# EAGLE schematic Decoder4to16 (EAGLE 7.3.0)

## Sheet 1 of 3
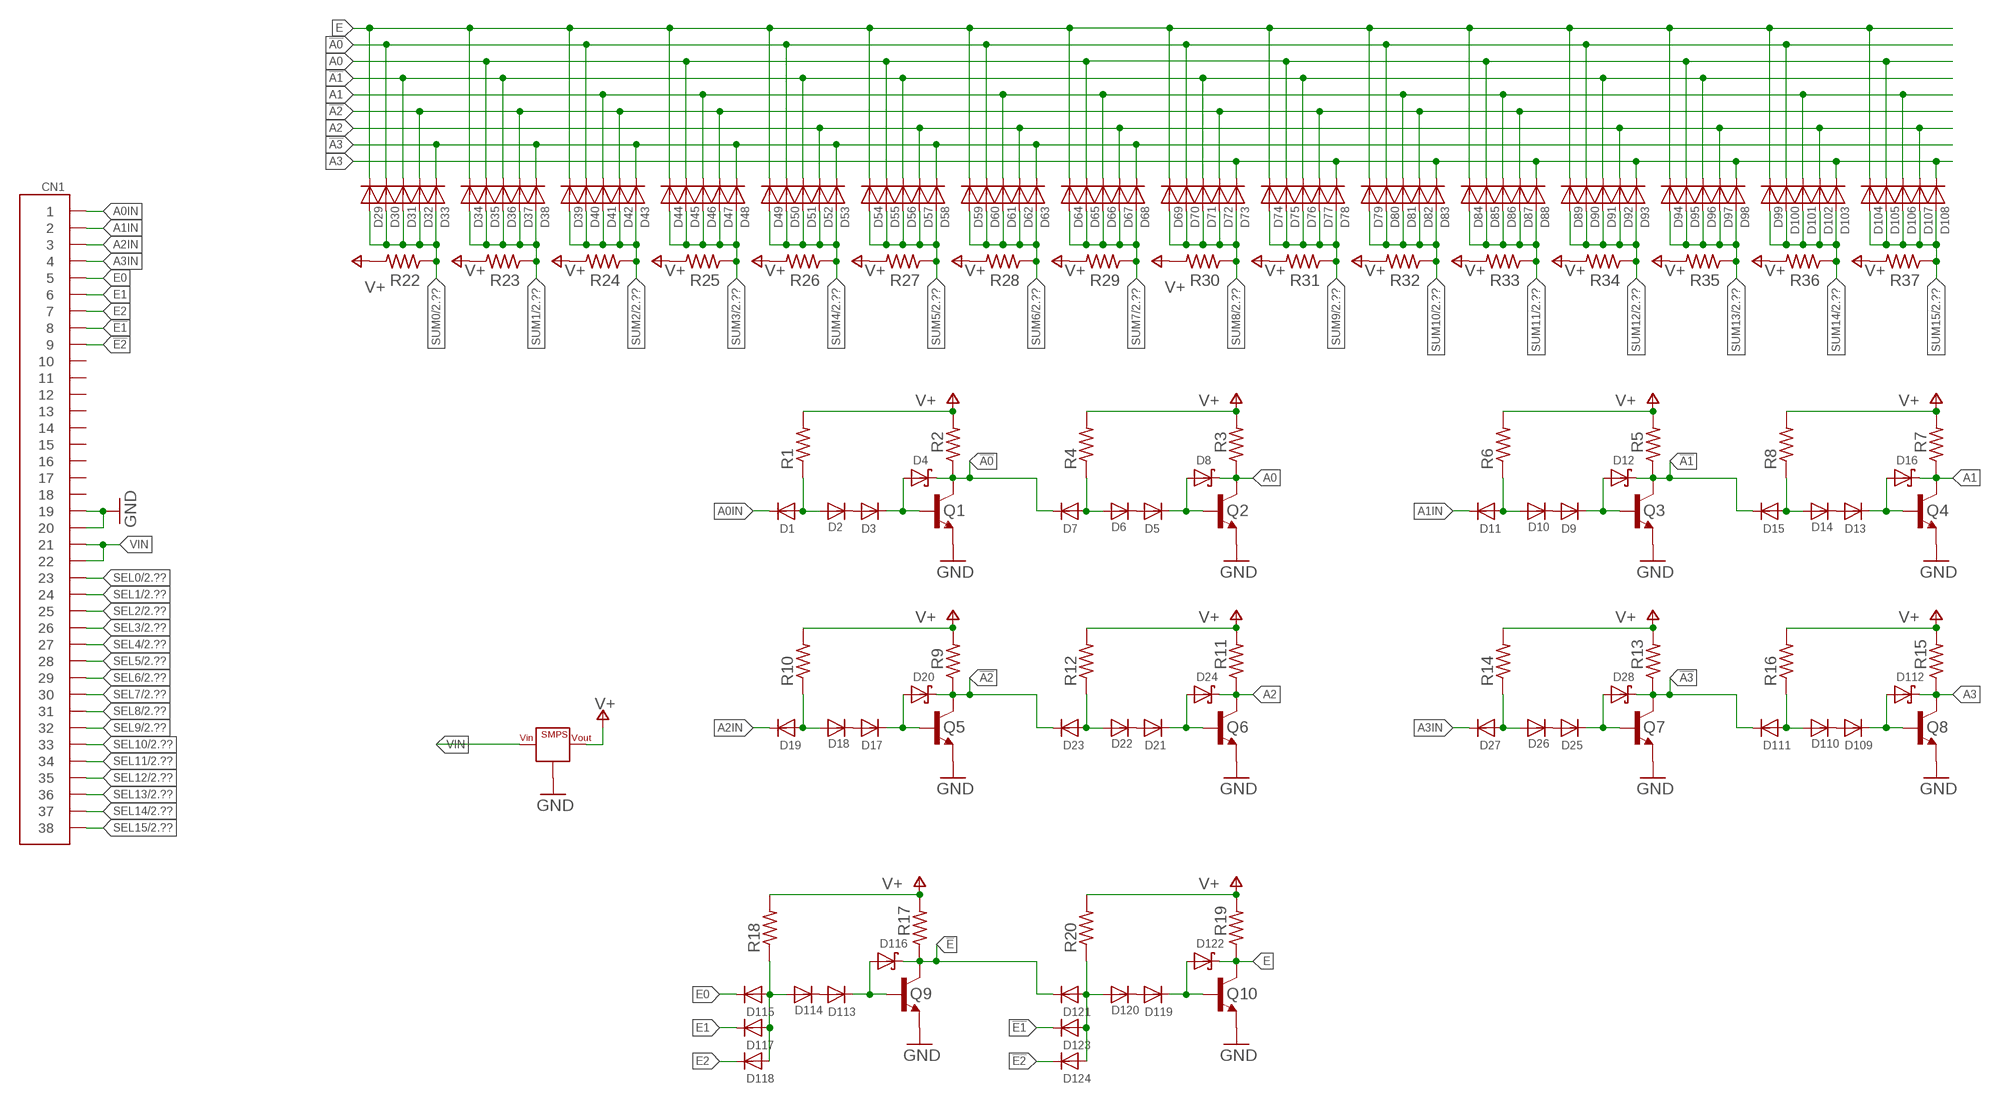
[diagram p0: schematic, sheet 1]

### Parts
CN1  HD38-HP  [HD38-HOLEPAD]
D1  DIODE-SOD323  [SOD323F]
D2  DIODE-SOD323  [SOD323F]
D3  DIODE-SOD323  [SOD323F]
D4  SCHOTTKYSOT323  [SOT23]
D5  DIODE-SOD323  [SOD323F]
D6  DIODE-SOD323  [SOD323F]
D7  DIODE-SOD323  [SOD323F]
D8  SCHOTTKYSOT323  [SOT23]
D9  DIODE-SOD323  [SOD323F]
D10  DIODE-SOD323  [SOD323F]
D11  DIODE-SOD323  [SOD323F]
D12  SCHOTTKYSOT323  [SOT23]
D13  DIODE-SOD323  [SOD323F]
D14  DIODE-SOD323  [SOD323F]
D15  DIODE-SOD323  [SOD323F]
D16  SCHOTTKYSOT323  [SOT23]
D17  DIODE-SOD323  [SOD323F]
D18  DIODE-SOD323  [SOD323F]
D19  DIODE-SOD323  [SOD323F]
D20  SCHOTTKYSOT323  [SOT23]
D21  DIODE-SOD323  [SOD323F]
D22  DIODE-SOD323  [SOD323F]
D23  DIODE-SOD323  [SOD323F]
D24  SCHOTTKYSOT323  [SOT23]
D25  DIODE-SOD323  [SOD323F]
D26  DIODE-SOD323  [SOD323F]
D27  DIODE-SOD323  [SOD323F]
D28  SCHOTTKYSOT323  [SOT23]
D29  DIODE-SOD323  [SOD323F]
D30  DIODE-SOD323  [SOD323F]
D31  DIODE-SOD323  [SOD323F]
D32  DIODE-SOD323  [SOD323F]
D33  DIODE-SOD323  [SOD323F]
D34  DIODE-SOD323  [SOD323F]
D35  DIODE-SOD323  [SOD323F]
D36  DIODE-SOD323  [SOD323F]
D37  DIODE-SOD323  [SOD323F]
D38  DIODE-SOD323  [SOD323F]
D39  DIODE-SOD323  [SOD323F]
D40  DIODE-SOD323  [SOD323F]
D41  DIODE-SOD323  [SOD323F]
D42  DIODE-SOD323  [SOD323F]
D43  DIODE-SOD323  [SOD323F]
D44  DIODE-SOD323  [SOD323F]
D45  DIODE-SOD323  [SOD323F]
D46  DIODE-SOD323  [SOD323F]
D47  DIODE-SOD323  [SOD323F]
D48  DIODE-SOD323  [SOD323F]
D49  DIODE-SOD323  [SOD323F]
D50  DIODE-SOD323  [SOD323F]
D51  DIODE-SOD323  [SOD323F]
D52  DIODE-SOD323  [SOD323F]
D53  DIODE-SOD323  [SOD323F]
D54  DIODE-SOD323  [SOD323F]
D55  DIODE-SOD323  [SOD323F]
D56  DIODE-SOD323  [SOD323F]
D57  DIODE-SOD323  [SOD323F]
D58  DIODE-SOD323  [SOD323F]
D59  DIODE-SOD323  [SOD323F]
D60  DIODE-SOD323  [SOD323F]
D61  DIODE-SOD323  [SOD323F]
D62  DIODE-SOD323  [SOD323F]
D63  DIODE-SOD323  [SOD323F]
D64  DIODE-SOD323  [SOD323F]
D65  DIODE-SOD323  [SOD323F]
D66  DIODE-SOD323  [SOD323F]
D67  DIODE-SOD323  [SOD323F]
D68  DIODE-SOD323  [SOD323F]
D69  DIODE-SOD323  [SOD323F]
D70  DIODE-SOD323  [SOD323F]
D71  DIODE-SOD323  [SOD323F]
D72  DIODE-SOD323  [SOD323F]
D73  DIODE-SOD323  [SOD323F]
D74  DIODE-SOD323  [SOD323F]
D75  DIODE-SOD323  [SOD323F]
D76  DIODE-SOD323  [SOD323F]
D77  DIODE-SOD323  [SOD323F]
D78  DIODE-SOD323  [SOD323F]
D79  DIODE-SOD323  [SOD323F]
D80  DIODE-SOD323  [SOD323F]
D81  DIODE-SOD323  [SOD323F]
D82  DIODE-SOD323  [SOD323F]
D83  DIODE-SOD323  [SOD323F]
D84  DIODE-SOD323  [SOD323F]
D85  DIODE-SOD323  [SOD323F]
D86  DIODE-SOD323  [SOD323F]
D87  DIODE-SOD323  [SOD323F]
D88  DIODE-SOD323  [SOD323F]
D89  DIODE-SOD323  [SOD323F]
D90  DIODE-SOD323  [SOD323F]
D91  DIODE-SOD323  [SOD323F]
D92  DIODE-SOD323  [SOD323F]
D93  DIODE-SOD323  [SOD323F]
D94  DIODE-SOD323  [SOD323F]
D95  DIODE-SOD323  [SOD323F]
D96  DIODE-SOD323  [SOD323F]
D97  DIODE-SOD323  [SOD323F]
D98  DIODE-SOD323  [SOD323F]
D99  DIODE-SOD323  [SOD323F]
D100  DIODE-SOD323  [SOD323F]
D101  DIODE-SOD323  [SOD323F]
D102  DIODE-SOD323  [SOD323F]
D103  DIODE-SOD323  [SOD323F]
D104  DIODE-SOD323  [SOD323F]
D105  DIODE-SOD323  [SOD323F]
D106  DIODE-SOD323  [SOD323F]
D107  DIODE-SOD323  [SOD323F]
D108  DIODE-SOD323  [SOD323F]
D109  DIODE-SOD323  [SOD323F]
D110  DIODE-SOD323  [SOD323F]
D111  DIODE-SOD323  [SOD323F]
D112  SCHOTTKYSOT323  [SOT23]
D113  DIODE-SOD323  [SOD323F]
D114  DIODE-SOD323  [SOD323F]
D115  DIODE-SOD323  [SOD323F]
D116  SCHOTTKYSOT323  [SOT23]
D117  DIODE-SOD323  [SOD323F]
D118  DIODE-SOD323  [SOD323F]
D119  DIODE-SOD323  [SOD323F]
D120  DIODE-SOD323  [SOD323F]
D121  DIODE-SOD323  [SOD323F]
D122  SCHOTTKYSOT323  [SOT23]
D123  DIODE-SOD323  [SOD323F]
D124  DIODE-SOD323  [SOD323F]
Q1  BC547-SOT23  [SOT23]
Q2  BC547-SOT23  [SOT23]
Q3  BC547-SOT23  [SOT23]
Q4  BC547-SOT23  [SOT23]
Q5  BC547-SOT23  [SOT23]
Q6  BC547-SOT23  [SOT23]
Q7  BC547-SOT23  [SOT23]
Q8  BC547-SOT23  [SOT23]
Q9  BC547-SOT23  [SOT23]
Q10  BC547-SOT23  [SOT23]
R1  470  R-0805  [R0805]
R2  150  R-0805  [R0805]
R3  150  R-0805  [R0805]
R4  470  R-0805  [R0805]
R5  150  R-0805  [R0805]
R6  470  R-0805  [R0805]
R7  150  R-0805  [R0805]
R8  470  R-0805  [R0805]
R9  150  R-0805  [R0805]
R10  470  R-0805  [R0805]
R11  150  R-0805  [R0805]
R12  470  R-0805  [R0805]
R13  150  R-0805  [R0805]
R14  470  R-0805  [R0805]
R15  150  R-0805  [R0805]
R16  470  R-0805  [R0805]
R17  150  R-0805  [R0805]
R18  470  R-0805  [R0805]
R19  150  R-0805  [R0805]
R20  470  R-0805  [R0805]
R22  R-0805  [R0805]
R23  R-0805  [R0805]
R24  R-0805  [R0805]
R25  R-0805  [R0805]
R26  R-0805  [R0805]
R27  R-0805  [R0805]
R28  R-0805  [R0805]
R29  R-0805  [R0805]
R30  R-0805  [R0805]
R31  R-0805  [R0805]
R32  R-0805  [R0805]
R33  R-0805  [R0805]
R34  R-0805  [R0805]
R35  R-0805  [R0805]
R36  R-0805  [R0805]
R37  R-0805  [R0805]
VR1  SMPS  [BUCK1722]

### Nets
!A0: D4.3(C) D7.C D30.C D40.C D50.C D60.C D70.C D80.C D90.C D100.C Q1.3(C) R2.1
!A1: D12.3(C) D15.C D31.C D36.C D51.C D56.C D71.C D76.C D91.C D96.C Q3.3(C) R5.1
!A2: D20.3(C) D23.C D32.C D37.C D42.C D47.C D72.C D77.C D82.C D87.C Q5.3(C) R9.1
!A3: D28.3(C) D33.C D38.C D43.C D48.C D53.C D58.C D63.C D68.C D111.C Q7.3(C) R13.1
!E: D116.3(C) D121.C Q9.3(C) R17.1
!E1: CN1.P8@1 CN1.P8@2 D123.C
!E2: CN1.P9@1 CN1.P9@2 D124.C
A0: D8.3(C) D35.C D45.C D55.C D65.C D75.C D85.C D95.C D105.C Q2.3(C) R3.1
A0IN: CN1.P1@1 CN1.P1@2 D1.C
A1: D16.3(C) D41.C D46.C D61.C D66.C D81.C D86.C D101.C D106.C Q4.3(C) R7.1
A1IN: CN1.P2@1 CN1.P2@2 D11.C
A2: D24.3(C) D52.C D57.C D62.C D67.C D92.C D97.C D102.C D107.C Q6.3(C) R11.1
A2IN: CN1.P3@1 CN1.P3@2 D19.C
A3: D73.C D78.C D83.C D88.C D93.C D98.C D103.C D108.C D112.3(C) Q8.3(C) R15.1
A3IN: CN1.P4@1 CN1.P4@2 D27.C
E: D29.C D34.C D39.C D44.C D49.C D54.C D59.C D64.C D69.C D74.C D79.C D84.C D89.C D94.C D99.C D104.C D122.3(C) Q10.3(C) R19.1
E0: CN1.P5@1 CN1.P5@2 D115.C
E1: CN1.P6@1 CN1.P6@2 D117.C
E2: CN1.P7@1 CN1.P7@2 D118.C
GND: CN1.P19@1 CN1.P19@2 CN1.P20@1 CN1.P20@2 Q1.2(E) Q2.2(E) Q3.2(E) Q4.2(E) Q5.2(E) Q6.2(E) Q7.2(E) Q8.2(E) Q9.2(E) Q10.2(E) VR1.GND@1(GND) VR1.GND@2(GND) VR1.GND@3(GND) VR1.GND@4(GND) ; also sheet 2
N$1: D1.A D2.A R1.1
N$2: D3.C D4.1(A) Q1.1(B)
N$3: D2.C D3.A
N$4: D5.C D8.1(A) Q2.1(B)
N$5: D5.A D6.C
N$6: D6.A D7.A R4.1
N$7: D9.C D12.1(A) Q3.1(B)
N$8: D9.A D10.C
N$9: D10.A D11.A R6.1
N$10: D13.C D16.1(A) Q4.1(B)
N$11: D13.A D14.C
N$12: D14.A D15.A R8.1
N$13: D17.C D20.1(A) Q5.1(B)
N$14: D17.A D18.C
N$15: D18.A D19.A R10.1
N$16: D21.C D24.1(A) Q6.1(B)
N$17: D21.A D22.C
N$18: D22.A D23.A R12.1
N$19: D25.C D28.1(A) Q7.1(B)
N$20: D25.A D26.C
N$21: D26.A D27.A R14.1
N$22: D109.C D112.1(A) Q8.1(B)
N$23: D109.A D110.C
N$24: D110.A D111.A R16.1
N$38: D113.C D116.1(A) Q9.1(B)
N$39: D113.A D114.C
N$40: D119.C D122.1(A) Q10.1(B)
N$41: D119.A D120.C
N$42: D120.A D121.A D123.A D124.A R20.1
N$43: D114.A D115.A D117.A D118.A R18.1
SEL0: CN1.P23@1 CN1.P23@2 ; also sheet 2
SEL1: CN1.P24@1 CN1.P24@2 ; also sheet 2
SEL2: CN1.P25@1 CN1.P25@2 ; also sheet 2
SEL3: CN1.P26@1 CN1.P26@2 ; also sheet 2
SEL4: CN1.P27@1 CN1.P27@2 ; also sheet 2
SEL5: CN1.P28@1 CN1.P28@2 ; also sheet 2
SEL6: CN1.P29@1 CN1.P29@2 ; also sheet 2
SEL7: CN1.P30@1 CN1.P30@2 ; also sheet 2
SEL8: CN1.P31@1 CN1.P31@2 ; also sheet 2
SEL9: CN1.P32@1 CN1.P32@2 ; also sheet 2
SEL10: CN1.P33@1 CN1.P33@2 ; also sheet 2
SEL11: CN1.P34@1 CN1.P34@2 ; also sheet 2
SEL12: CN1.P35@1 CN1.P35@2 ; also sheet 2
SEL13: CN1.P36@1 CN1.P36@2 ; also sheet 2
SEL14: CN1.P37@1 CN1.P37@2 ; also sheet 2
SEL15: CN1.P38@1 CN1.P38@2 ; also sheet 2
SUM0: D29.A D30.A D31.A D32.A D33.A R22.1 ; also sheet 2
SUM1: D34.A D35.A D36.A D37.A D38.A R23.1 ; also sheet 2
SUM2: D39.A D40.A D41.A D42.A D43.A R24.1 ; also sheet 2
SUM3: D44.A D45.A D46.A D47.A D48.A R25.1 ; also sheet 2
SUM4: D49.A D50.A D51.A D52.A D53.A R26.1 ; also sheet 2
SUM5: D54.A D55.A D56.A D57.A D58.A R27.1 ; also sheet 2
SUM6: D59.A D60.A D61.A D62.A D63.A R28.1 ; also sheet 2
SUM7: D64.A D65.A D66.A D67.A D68.A R29.1 ; also sheet 2
SUM8: D69.A D70.A D71.A D72.A D73.A R30.1 ; also sheet 2
SUM9: D74.A D75.A D76.A D77.A D78.A R31.1 ; also sheet 2
SUM10: D79.A D80.A D81.A D82.A D83.A R32.1 ; also sheet 2
SUM11: D84.A D85.A D86.A D87.A D88.A R33.1 ; also sheet 2
SUM12: D89.A D90.A D91.A D92.A D93.A R34.1 ; also sheet 2
SUM13: D94.A D95.A D96.A D97.A D98.A R35.1 ; also sheet 2
SUM14: D99.A D100.A D101.A D102.A D103.A R36.1 ; also sheet 2
SUM15: D104.A D105.A D106.A D107.A D108.A R37.1 ; also sheet 2
V+: R1.2 R2.2 R3.2 R4.2 R5.2 R6.2 R7.2 R8.2 R9.2 R10.2 R11.2 R12.2 R13.2 R14.2 R15.2 R16.2 R17.2 R18.2 R19.2 R20.2 R22.2 R23.2 R24.2 R25.2 R26.2 R27.2 R28.2 R29.2 R30.2 R31.2 R32.2 R33.2 R34.2 R35.2 R36.2 R37.2 VR1.OUT@1(VOUT) VR1.OUT@2(VOUT) ; also sheet 2
VIN: CN1.P21@1 CN1.P21@2 CN1.P22@1 CN1.P22@2 VR1.IN@1(VIN) VR1.IN@2(VIN)
Unconnected: CN1.P10@1 CN1.P10@2 CN1.P11@1 CN1.P11@2 CN1.P12@1 CN1.P12@2 CN1.P13@1 CN1.P13@2 CN1.P14@1 CN1.P14@2 CN1.P15@1 CN1.P15@2 CN1.P16@1 CN1.P16@2 CN1.P17@1 CN1.P17@2 CN1.P18@1 CN1.P18@2

## Sheet 2 of 3
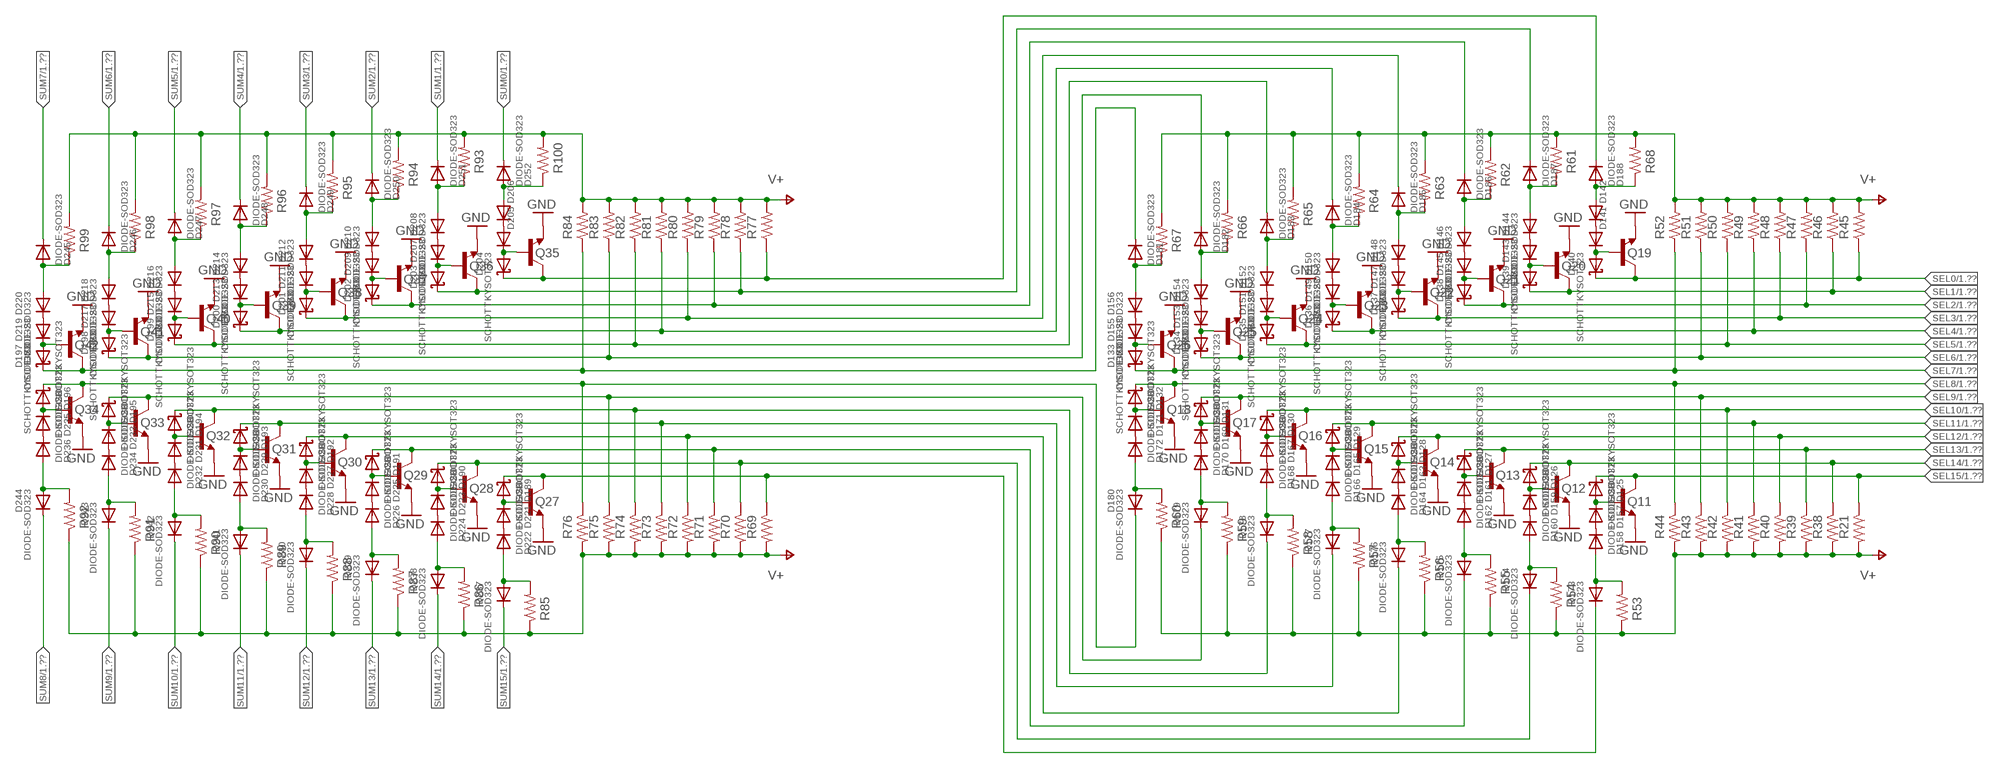
[diagram p1: schematic, sheet 2]

### Parts
D125  SCHOTTKYSOT323  [SOT23]
D126  SCHOTTKYSOT323  [SOT23]
D127  SCHOTTKYSOT323  [SOT23]
D128  SCHOTTKYSOT323  [SOT23]
D129  SCHOTTKYSOT323  [SOT23]
D130  SCHOTTKYSOT323  [SOT23]
D131  SCHOTTKYSOT323  [SOT23]
D132  SCHOTTKYSOT323  [SOT23]
D133  SCHOTTKYSOT323  [SOT23]
D134  SCHOTTKYSOT323  [SOT23]
D135  SCHOTTKYSOT323  [SOT23]
D136  SCHOTTKYSOT323  [SOT23]
D137  SCHOTTKYSOT323  [SOT23]
D138  SCHOTTKYSOT323  [SOT23]
D139  SCHOTTKYSOT323  [SOT23]
D140  SCHOTTKYSOT323  [SOT23]
D141  DIODE-SOD323  [SOD323F]
D142  DIODE-SOD323  [SOD323F]
D143  DIODE-SOD323  [SOD323F]
D144  DIODE-SOD323  [SOD323F]
D145  DIODE-SOD323  [SOD323F]
D146  DIODE-SOD323  [SOD323F]
D147  DIODE-SOD323  [SOD323F]
D148  DIODE-SOD323  [SOD323F]
D149  DIODE-SOD323  [SOD323F]
D150  DIODE-SOD323  [SOD323F]
D151  DIODE-SOD323  [SOD323F]
D152  DIODE-SOD323  [SOD323F]
D153  DIODE-SOD323  [SOD323F]
D154  DIODE-SOD323  [SOD323F]
D155  DIODE-SOD323  [SOD323F]
D156  DIODE-SOD323  [SOD323F]
D157  DIODE-SOD323  [SOD323F]
D158  DIODE-SOD323  [SOD323F]
D159  DIODE-SOD323  [SOD323F]
D160  DIODE-SOD323  [SOD323F]
D161  DIODE-SOD323  [SOD323F]
D162  DIODE-SOD323  [SOD323F]
D163  DIODE-SOD323  [SOD323F]
D164  DIODE-SOD323  [SOD323F]
D165  DIODE-SOD323  [SOD323F]
D166  DIODE-SOD323  [SOD323F]
D167  DIODE-SOD323  [SOD323F]
D168  DIODE-SOD323  [SOD323F]
D169  DIODE-SOD323  [SOD323F]
D170  DIODE-SOD323  [SOD323F]
D171  DIODE-SOD323  [SOD323F]
D172  DIODE-SOD323  [SOD323F]
D173  DIODE-SOD323  [SOD323F]
D174  DIODE-SOD323  [SOD323F]
D175  DIODE-SOD323  [SOD323F]
D176  DIODE-SOD323  [SOD323F]
D177  DIODE-SOD323  [SOD323F]
D178  DIODE-SOD323  [SOD323F]
D179  DIODE-SOD323  [SOD323F]
D180  DIODE-SOD323  [SOD323F]
D181  DIODE-SOD323  [SOD323F]
D182  DIODE-SOD323  [SOD323F]
D183  DIODE-SOD323  [SOD323F]
D184  DIODE-SOD323  [SOD323F]
D185  DIODE-SOD323  [SOD323F]
D186  DIODE-SOD323  [SOD323F]
D187  DIODE-SOD323  [SOD323F]
D188  DIODE-SOD323  [SOD323F]
D189  SCHOTTKYSOT323  [SOT23]
D190  SCHOTTKYSOT323  [SOT23]
D191  SCHOTTKYSOT323  [SOT23]
D192  SCHOTTKYSOT323  [SOT23]
D193  SCHOTTKYSOT323  [SOT23]
D194  SCHOTTKYSOT323  [SOT23]
D195  SCHOTTKYSOT323  [SOT23]
D196  SCHOTTKYSOT323  [SOT23]
D197  SCHOTTKYSOT323  [SOT23]
D198  SCHOTTKYSOT323  [SOT23]
D199  SCHOTTKYSOT323  [SOT23]
D200  SCHOTTKYSOT323  [SOT23]
D201  SCHOTTKYSOT323  [SOT23]
D202  SCHOTTKYSOT323  [SOT23]
D203  SCHOTTKYSOT323  [SOT23]
D204  SCHOTTKYSOT323  [SOT23]
D205  DIODE-SOD323  [SOD323F]
D206  DIODE-SOD323  [SOD323F]
D207  DIODE-SOD323  [SOD323F]
D208  DIODE-SOD323  [SOD323F]
D209  DIODE-SOD323  [SOD323F]
D210  DIODE-SOD323  [SOD323F]
D211  DIODE-SOD323  [SOD323F]
D212  DIODE-SOD323  [SOD323F]
D213  DIODE-SOD323  [SOD323F]
D214  DIODE-SOD323  [SOD323F]
D215  DIODE-SOD323  [SOD323F]
D216  DIODE-SOD323  [SOD323F]
D217  DIODE-SOD323  [SOD323F]
D218  DIODE-SOD323  [SOD323F]
D219  DIODE-SOD323  [SOD323F]
D220  DIODE-SOD323  [SOD323F]
D221  DIODE-SOD323  [SOD323F]
D222  DIODE-SOD323  [SOD323F]
D223  DIODE-SOD323  [SOD323F]
D224  DIODE-SOD323  [SOD323F]
D225  DIODE-SOD323  [SOD323F]
D226  DIODE-SOD323  [SOD323F]
D227  DIODE-SOD323  [SOD323F]
D228  DIODE-SOD323  [SOD323F]
D229  DIODE-SOD323  [SOD323F]
D230  DIODE-SOD323  [SOD323F]
D231  DIODE-SOD323  [SOD323F]
D232  DIODE-SOD323  [SOD323F]
D233  DIODE-SOD323  [SOD323F]
D234  DIODE-SOD323  [SOD323F]
D235  DIODE-SOD323  [SOD323F]
D236  DIODE-SOD323  [SOD323F]
D237  DIODE-SOD323  [SOD323F]
D238  DIODE-SOD323  [SOD323F]
D239  DIODE-SOD323  [SOD323F]
D240  DIODE-SOD323  [SOD323F]
D241  DIODE-SOD323  [SOD323F]
D242  DIODE-SOD323  [SOD323F]
D243  DIODE-SOD323  [SOD323F]
D244  DIODE-SOD323  [SOD323F]
D245  DIODE-SOD323  [SOD323F]
D246  DIODE-SOD323  [SOD323F]
D247  DIODE-SOD323  [SOD323F]
D248  DIODE-SOD323  [SOD323F]
D249  DIODE-SOD323  [SOD323F]
D250  DIODE-SOD323  [SOD323F]
D251  DIODE-SOD323  [SOD323F]
D252  DIODE-SOD323  [SOD323F]
Q11  BC547-SOT23  [SOT23]
Q12  BC547-SOT23  [SOT23]
Q13  BC547-SOT23  [SOT23]
Q14  BC547-SOT23  [SOT23]
Q15  BC547-SOT23  [SOT23]
Q16  BC547-SOT23  [SOT23]
Q17  BC547-SOT23  [SOT23]
Q18  BC547-SOT23  [SOT23]
Q19  BC547-SOT23  [SOT23]
Q20  BC547-SOT23  [SOT23]
Q21  BC547-SOT23  [SOT23]
Q22  BC547-SOT23  [SOT23]
Q23  BC547-SOT23  [SOT23]
Q24  BC547-SOT23  [SOT23]
Q25  BC547-SOT23  [SOT23]
Q26  BC547-SOT23  [SOT23]
Q27  BC547-SOT23  [SOT23]
Q28  BC547-SOT23  [SOT23]
Q29  BC547-SOT23  [SOT23]
Q30  BC547-SOT23  [SOT23]
Q31  BC547-SOT23  [SOT23]
Q32  BC547-SOT23  [SOT23]
Q33  BC547-SOT23  [SOT23]
Q34  BC547-SOT23  [SOT23]
Q35  BC547-SOT23  [SOT23]
Q36  BC547-SOT23  [SOT23]
Q37  BC547-SOT23  [SOT23]
Q38  BC547-SOT23  [SOT23]
Q39  BC547-SOT23  [SOT23]
Q40  BC547-SOT23  [SOT23]
Q41  BC547-SOT23  [SOT23]
Q42  BC547-SOT23  [SOT23]
R21  R-0805  [R0805]
R38  R-0805  [R0805]
R39  R-0805  [R0805]
R40  R-0805  [R0805]
R41  R-0805  [R0805]
R42  R-0805  [R0805]
R43  R-0805  [R0805]
R44  R-0805  [R0805]
R45  R-0805  [R0805]
R46  R-0805  [R0805]
R47  R-0805  [R0805]
R48  R-0805  [R0805]
R49  R-0805  [R0805]
R50  R-0805  [R0805]
R51  R-0805  [R0805]
R52  R-0805  [R0805]
R53  R-0805  [R0805]
R54  R-0805  [R0805]
R55  R-0805  [R0805]
R56  R-0805  [R0805]
R57  R-0805  [R0805]
R58  R-0805  [R0805]
R59  R-0805  [R0805]
R60  R-0805  [R0805]
R61  R-0805  [R0805]
R62  R-0805  [R0805]
R63  R-0805  [R0805]
R64  R-0805  [R0805]
R65  R-0805  [R0805]
R66  R-0805  [R0805]
R67  R-0805  [R0805]
R68  R-0805  [R0805]
R69  R-0805  [R0805]
R70  R-0805  [R0805]
R71  R-0805  [R0805]
R72  R-0805  [R0805]
R73  R-0805  [R0805]
R74  R-0805  [R0805]
R75  R-0805  [R0805]
R76  R-0805  [R0805]
R77  R-0805  [R0805]
R78  R-0805  [R0805]
R79  R-0805  [R0805]
R80  R-0805  [R0805]
R81  R-0805  [R0805]
R82  R-0805  [R0805]
R83  R-0805  [R0805]
R84  R-0805  [R0805]
R85  R-0805  [R0805]
R86  R-0805  [R0805]
R87  R-0805  [R0805]
R88  R-0805  [R0805]
R89  R-0805  [R0805]
R90  R-0805  [R0805]
R91  R-0805  [R0805]
R92  R-0805  [R0805]
R93  R-0805  [R0805]
R94  R-0805  [R0805]
R95  R-0805  [R0805]
R96  R-0805  [R0805]
R97  R-0805  [R0805]
R98  R-0805  [R0805]
R99  R-0805  [R0805]
R100  R-0805  [R0805]

### Nets
GND: Q11.2(E) Q12.2(E) Q13.2(E) Q14.2(E) Q15.2(E) Q16.2(E) Q17.2(E) Q18.2(E) Q19.2(E) Q20.2(E) Q21.2(E) Q22.2(E) Q23.2(E) Q24.2(E) Q25.2(E) Q26.2(E) Q27.2(E) Q28.2(E) Q29.2(E) Q30.2(E) Q31.2(E) Q32.2(E) Q33.2(E) Q34.2(E) Q35.2(E) Q36.2(E) Q37.2(E) Q38.2(E) Q39.2(E) Q40.2(E) Q41.2(E) Q42.2(E) ; also sheet 1
N$25: D125.1(A) D157.C Q11.1(B)
N$26: D126.1(A) D159.C Q12.1(B)
N$27: D127.1(A) D161.C Q13.1(B)
N$28: D128.1(A) D163.C Q14.1(B)
N$29: D129.1(A) D165.C Q15.1(B)
N$30: D130.1(A) D167.C Q16.1(B)
N$31: D131.1(A) D169.C Q17.1(B)
N$32: D132.1(A) D171.C Q18.1(B)
N$33: D140.1(A) D141.C Q19.1(B)
N$34: D139.1(A) D143.C Q20.1(B)
N$35: D138.1(A) D145.C Q21.1(B)
N$36: D137.1(A) D147.C Q22.1(B)
N$37: D136.1(A) D149.C Q23.1(B)
N$44: D135.1(A) D151.C Q24.1(B)
N$45: D134.1(A) D153.C Q25.1(B)
N$46: D133.1(A) D155.C Q26.1(B)
N$49: D141.A D142.C
N$50: D143.A D144.C
N$51: D145.A D146.C
N$52: D147.A D148.C
N$53: D149.A D150.C
N$54: D151.A D152.C
N$55: D153.A D154.C
N$56: D155.A D156.C
N$57: D157.A D158.C
N$58: D159.A D160.C
N$59: D161.A D162.C
N$60: D163.A D164.C
N$61: D165.A D166.C
N$62: D167.A D168.C
N$63: D169.A D170.C
N$64: D171.A D172.C
N$65: D158.A D173.A R53.2
N$66: D160.A D174.A R54.2
N$67: D162.A D175.A R55.2
N$68: D164.A D176.A R56.2
N$69: D166.A D177.A R57.2
N$70: D168.A D178.A R58.2
N$71: D170.A D179.A R59.2
N$72: D172.A D180.A R60.2
N$73: D156.A D181.A R67.1
N$74: D154.A D182.A R66.1
N$75: D152.A D183.A R65.1
N$76: D150.A D184.A R64.1
N$77: D148.A D185.A R63.1
N$78: D146.A D186.A R62.1
N$79: D144.A D187.A R61.1
N$89: D142.A D188.A R68.1
N$97: D189.1(A) D221.C Q27.1(B)
N$98: D190.1(A) D223.C Q28.1(B)
N$99: D191.1(A) D225.C Q29.1(B)
N$100: D192.1(A) D227.C Q30.1(B)
N$101: D193.1(A) D229.C Q31.1(B)
N$102: D194.1(A) D231.C Q32.1(B)
N$103: D195.1(A) D233.C Q33.1(B)
N$104: D196.1(A) D235.C Q34.1(B)
N$105: D204.1(A) D205.C Q35.1(B)
N$106: D203.1(A) D207.C Q36.1(B)
N$107: D202.1(A) D209.C Q37.1(B)
N$108: D201.1(A) D211.C Q38.1(B)
N$109: D200.1(A) D213.C Q39.1(B)
N$110: D199.1(A) D215.C Q40.1(B)
N$111: D198.1(A) D217.C Q41.1(B)
N$112: D197.1(A) D219.C Q42.1(B)
N$113: D205.A D206.C
N$114: D207.A D208.C
N$115: D209.A D210.C
N$116: D211.A D212.C
N$117: D213.A D214.C
N$118: D215.A D216.C
N$119: D217.A D218.C
N$120: D219.A D220.C
N$121: D221.A D222.C
N$122: D223.A D224.C
N$123: D225.A D226.C
N$124: D227.A D228.C
N$125: D229.A D230.C
N$126: D231.A D232.C
N$127: D233.A D234.C
N$128: D235.A D236.C
N$129: D222.A D237.A R85.2
N$130: D224.A D238.A R86.2
N$131: D226.A D239.A R87.2
N$132: D228.A D240.A R88.2
N$133: D230.A D241.A R89.2
N$134: D232.A D242.A R90.2
N$135: D234.A D243.A R91.2
N$136: D236.A D244.A R92.2
N$137: D220.A D245.A R99.1
N$138: D218.A D246.A R98.1
N$139: D216.A D247.A R97.1
N$140: D214.A D248.A R96.1
N$141: D212.A D249.A R95.1
N$142: D210.A D250.A R94.1
N$143: D208.A D251.A R93.1
N$159: D206.A D252.A R100.1
SEL0: D140.3(C) Q19.3(C) R45.1 ; also sheet 1
SEL1: D139.3(C) Q20.3(C) R46.1 ; also sheet 1
SEL2: D138.3(C) Q21.3(C) R47.1 ; also sheet 1
SEL3: D137.3(C) Q22.3(C) R48.1 ; also sheet 1
SEL4: D136.3(C) Q23.3(C) R49.1 ; also sheet 1
SEL5: D135.3(C) Q24.3(C) R50.1 ; also sheet 1
SEL6: D134.3(C) Q25.3(C) R51.1 ; also sheet 1
SEL7: D133.3(C) Q26.3(C) R52.1 ; also sheet 1
SEL8: D132.3(C) Q18.3(C) R44.1 ; also sheet 1
SEL9: D131.3(C) Q17.3(C) R43.1 ; also sheet 1
SEL10: D130.3(C) Q16.3(C) R42.1 ; also sheet 1
SEL11: D129.3(C) Q15.3(C) R41.1 ; also sheet 1
SEL12: D128.3(C) Q14.3(C) R40.1 ; also sheet 1
SEL13: D127.3(C) Q13.3(C) R39.1 ; also sheet 1
SEL14: D126.3(C) Q12.3(C) R38.1 ; also sheet 1
SEL15: D125.3(C) Q11.3(C) R21.1 ; also sheet 1
SUM0: D252.C ; also sheet 1
SUM1: D251.C ; also sheet 1
SUM2: D250.C ; also sheet 1
SUM3: D249.C ; also sheet 1
SUM4: D248.C ; also sheet 1
SUM5: D247.C ; also sheet 1
SUM6: D246.C ; also sheet 1
SUM7: D245.C ; also sheet 1
SUM8: D244.C ; also sheet 1
SUM9: D243.C ; also sheet 1
SUM10: D242.C ; also sheet 1
SUM11: D241.C ; also sheet 1
SUM12: D240.C ; also sheet 1
SUM13: D239.C ; also sheet 1
SUM14: D238.C ; also sheet 1
SUM15: D237.C ; also sheet 1
V+: R21.2 R38.2 R39.2 R40.2 R41.2 R42.2 R43.2 R44.2 R45.2 R46.2 R47.2 R48.2 R49.2 R50.2 R51.2 R52.2 R53.1 R54.1 R55.1 R56.1 R57.1 R58.1 R59.1 R60.1 R61.2 R62.2 R63.2 R64.2 R65.2 R66.2 R67.2 R68.2 R69.2 R70.2 R71.2 R72.2 R73.2 R74.2 R75.2 R76.2 R77.2 R78.2 R79.2 R80.2 R81.2 R82.2 R83.2 R84.2 R85.1 R86.1 R87.1 R88.1 R89.1 R90.1 R91.1 R92.1 R93.2 R94.2 R95.2 R96.2 R97.2 R98.2 R99.2 R100.2 ; also sheet 1
Z0: D188.C D204.3(C) Q35.3(C) R77.1
Z1: D187.C D203.3(C) Q36.3(C) R78.1
Z2: D186.C D202.3(C) Q37.3(C) R79.1
Z3: D185.C D201.3(C) Q38.3(C) R80.1
Z4: D184.C D200.3(C) Q39.3(C) R81.1
Z5: D183.C D199.3(C) Q40.3(C) R82.1
Z6: D182.C D198.3(C) Q41.3(C) R83.1
Z7: D181.C D197.3(C) Q42.3(C) R84.1
Z8: D180.C D196.3(C) Q34.3(C) R76.1
Z9: D179.C D195.3(C) Q33.3(C) R75.1
Z10: D178.C D194.3(C) Q32.3(C) R74.1
Z11: D177.C D193.3(C) Q31.3(C) R73.1
Z12: D176.C D192.3(C) Q30.3(C) R72.1
Z13: D175.C D191.3(C) Q29.3(C) R71.1
Z14: D174.C D190.3(C) Q28.3(C) R70.1
Z15: D173.C D189.3(C) Q27.3(C) R69.1

## Sheet 3 of 3

## Library data of the parts
CN1 = SmallRoomLabs_ConSwitch:HD38
D1-D3 D5-D7 D9-D11 D13-D15 D17-D19 D21-D23 D25-D27 D29-D111 D113-D115 D117-D121 D123 D124 D141-D188 D205-D252 = SmallRoomLabs_Semiconductor:DIODE
D4 D8 D12 D16 D20 D24 D28 D112 D116 D122 D125-D140 D189-D204 = SmallRoomLabs_Semiconductor:SCHOTTKY
Q1-Q42 = SmallRoomLabs_Semiconductor:BC547
R1-R100 = SmallRoomLabs_Discrete:R
VR1 = SmallRoomLabs_Battery:SMPS